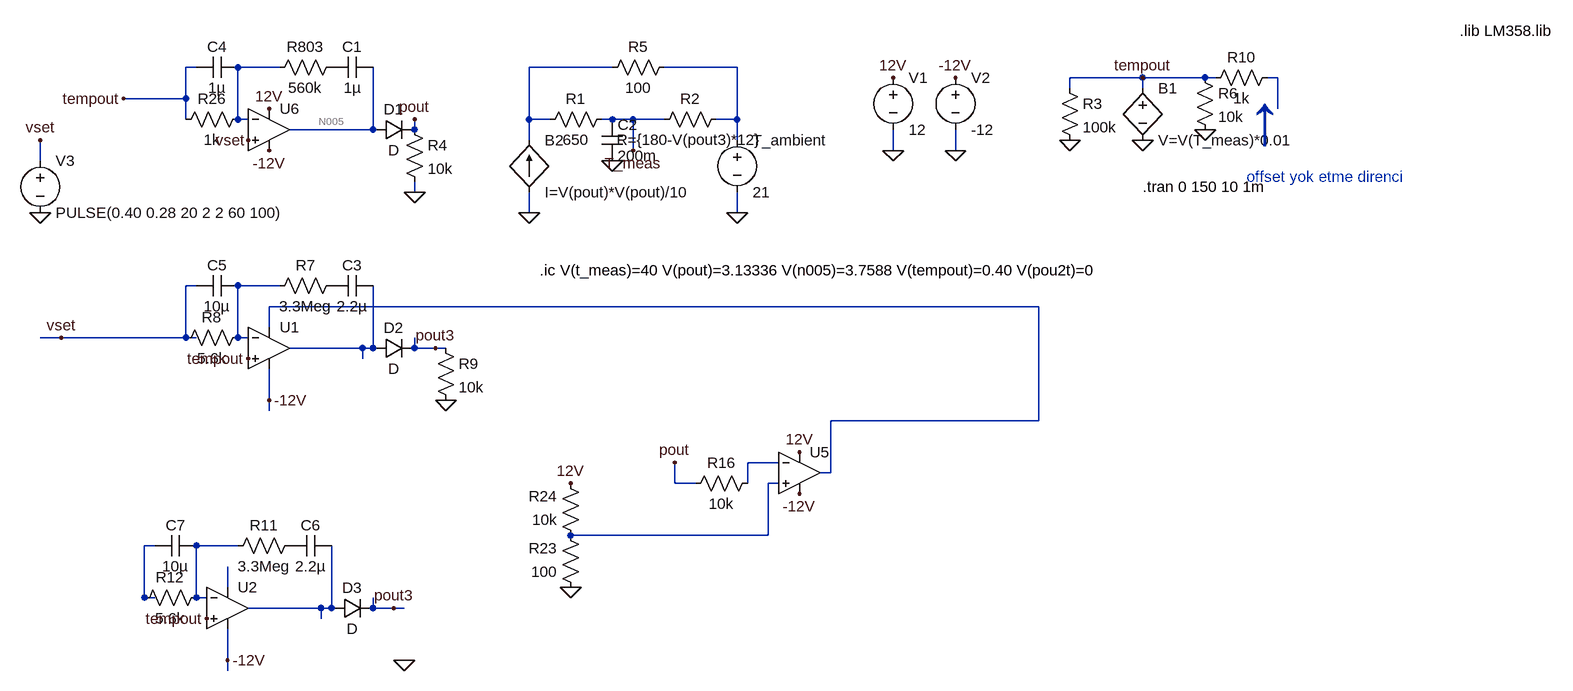
[diagram p0: schematic part-2v11.asc]
part-2v11.asc, the LTspice schematic file:
Version 4
SHEET 1 3304 1124
WIRE 1200 -336 1184 -336
WIRE 1328 -336 1264 -336
WIRE 1840 -336 1712 -336
WIRE 2032 -336 1920 -336
WIRE 2656 -320 2544 -320
WIRE 2752 -320 2656 -320
WIRE 2768 -320 2752 -320
WIRE 2864 -320 2848 -320
WIRE 2544 -304 2544 -320
WIRE 2656 -304 2656 -320
WIRE 1184 -288 1184 -336
WIRE 1184 -288 1088 -288
WIRE 2864 -272 2864 -320
WIRE 1184 -256 1184 -288
WIRE 1264 -256 1264 -336
WIRE 1280 -256 1264 -256
WIRE 1712 -256 1712 -336
WIRE 1744 -256 1712 -256
WIRE 1840 -256 1824 -256
WIRE 1872 -256 1840 -256
WIRE 1920 -256 1872 -256
WIRE 2032 -256 2032 -336
WIRE 2032 -256 2000 -256
WIRE 1472 -240 1472 -336
WIRE 1472 -240 1344 -240
WIRE 1536 -240 1536 -256
WIRE 1712 -224 1712 -256
WIRE 2032 -224 2032 -256
WIRE 1872 -208 1872 -256
WIRE 2272 -208 2272 -240
WIRE 2368 -208 2368 -240
WIRE 960 -192 960 -224
WIRE 1536 -144 1536 -160
WIRE 1712 -112 1712 -144
WIRE 2032 -112 2032 -144
WIRE 1200 0 1184 0
WIRE 1328 0 1264 0
WIRE 2496 32 1312 32
WIRE 1312 64 1312 32
WIRE 992 80 960 80
WIRE 1184 80 1184 0
WIRE 1184 80 992 80
WIRE 1200 80 1184 80
WIRE 1264 80 1264 0
WIRE 1280 80 1264 80
WIRE 1456 96 1344 96
WIRE 1472 96 1472 0
WIRE 1472 96 1456 96
WIRE 1536 96 1536 80
WIRE 1568 96 1536 96
WIRE 1584 96 1568 96
WIRE 1456 112 1456 96
WIRE 1312 176 1312 128
WIRE 1312 192 1312 176
WIRE 2496 208 2496 32
WIRE 2496 208 2176 208
WIRE 2096 272 2048 272
WIRE 2176 288 2176 208
WIRE 2176 288 2160 288
WIRE 1936 304 1936 272
WIRE 1968 304 1936 304
WIRE 2048 304 2048 272
WIRE 2096 304 2080 304
WIRE 2080 384 2080 304
WIRE 2080 384 1776 384
WIRE 1136 400 1120 400
WIRE 1264 400 1200 400
WIRE 1248 464 1248 432
WIRE 1120 480 1120 400
WIRE 1136 480 1120 480
WIRE 1200 480 1200 400
WIRE 1216 480 1200 480
WIRE 1392 496 1280 496
WIRE 1408 496 1408 400
WIRE 1408 496 1392 496
WIRE 1472 496 1472 480
WIRE 1504 496 1472 496
WIRE 1520 496 1504 496
WIRE 1392 512 1392 496
WIRE 1248 576 1248 528
WIRE 1248 592 1248 576
FLAG 2032 -112 0
FLAG 1712 -112 0
FLAG 1872 -208 T_meas
FLAG 2656 -224 0
FLAG 2544 -224 0
FLAG 2272 -208 0
FLAG 2272 -320 12V
FLAG 2368 -208 0
FLAG 2368 -320 -12V
FLAG 2752 -240 0
FLAG 1312 -208 -12V
FLAG 1312 -272 12V
FLAG 960 -112 0
FLAG 2656 -320 tempout
FLAG 1088 -288 tempout
FLAG 1840 -192 0
FLAG 1536 -256 pout
FLAG 1536 -144 0
FLAG 1280 112 tempout
FLAG 1584 176 0
FLAG 960 -224 vset
FLAG 1280 -224 vset
FLAG 992 80 vset
FLAG 2128 256 12V
FLAG 1568 96 pout3
FLAG 1936 272 pout
FLAG 2128 320 -12V
FLAG 1312 176 -12V
FLAG 1776 464 0
FLAG 1776 304 12V
FLAG 1216 512 tempout
FLAG 1520 576 0
FLAG 1504 496 pout3
FLAG 1248 576 -12V
SYMBOL voltage 2032 -240 R0
WINDOW 123 0 0 Left 0
WINDOW 39 0 0 Left 0
SYMATTR InstName T_ambient
SYMATTR Value 21
SYMBOL res 1840 -272 R90
WINDOW 0 0 56 VBottom 2
WINDOW 3 32 56 VTop 2
SYMATTR InstName R1
SYMATTR Value 650
SYMBOL res 2016 -272 R90
WINDOW 0 0 56 VBottom 2
WINDOW 3 32 56 VTop 2
SYMATTR InstName R2
SYMATTR Value R={180-V(pout3)*12}
SYMBOL bv 2656 -320 R0
SYMATTR InstName B1
SYMATTR Value V=V(T_meas)*0.01
SYMBOL res 2528 -320 R0
SYMATTR InstName R3
SYMATTR Value 100k
SYMBOL voltage 2272 -336 R0
SYMATTR InstName V1
SYMATTR Value 12
SYMBOL voltage 2368 -336 R0
WINDOW 123 0 0 Left 0
WINDOW 39 0 0 Left 0
SYMATTR InstName V2
SYMATTR Value -12
SYMBOL res 2736 -336 R0
SYMATTR InstName R6
SYMATTR Value 10k
SYMBOL res 2864 -336 R90
WINDOW 0 0 56 VBottom 2
WINDOW 3 32 56 VTop 2
SYMATTR InstName R10
SYMATTR Value 1k
SYMBOL Opamps\\UniversalOpamp2 1312 -240 R0
SYMATTR InstName U6
SYMBOL res 1424 -352 R90
WINDOW 0 0 56 VBottom 2
WINDOW 3 32 56 VTop 2
SYMATTR InstName R803
SYMATTR Value 560k
SYMBOL res 1280 -272 R90
WINDOW 0 0 56 VBottom 2
WINDOW 3 32 56 VTop 2
SYMATTR InstName R26
SYMATTR Value 1k
SYMBOL voltage 960 -208 R0
WINDOW 123 0 0 Left 0
WINDOW 39 0 0 Left 0
SYMATTR InstName V3
SYMATTR Value PULSE(0.40 0.28 20 2 2 60 100)
SYMBOL bi2 1712 -224 R0
SYMATTR InstName B2
SYMATTR Value I=V(pout)*V(pout)/10
SYMBOL cap 1824 -256 R0
SYMATTR InstName C2
SYMATTR Value 200m
SYMBOL res 1936 -352 R90
WINDOW 0 0 56 VBottom 2
WINDOW 3 32 56 VTop 2
SYMATTR InstName R5
SYMATTR Value 100
SYMBOL diode 1472 -224 R270
WINDOW 0 32 32 VTop 2
WINDOW 3 0 32 VBottom 2
SYMATTR InstName D1
SYMBOL res 1520 -256 R0
SYMATTR InstName R4
SYMATTR Value 10k
SYMBOL Opamps\\UniversalOpamp2 1312 96 R0
SYMATTR InstName U1
SYMBOL res 1424 -16 R90
WINDOW 0 0 56 VBottom 2
WINDOW 3 32 56 VTop 2
SYMATTR InstName R7
SYMATTR Value 3.3Meg
SYMBOL res 1280 64 R90
WINDOW 0 0 56 VBottom 2
WINDOW 3 32 56 VTop 2
SYMATTR InstName R8
SYMATTR Value 5.6k
SYMBOL cap 1472 -16 R90
WINDOW 0 0 32 VBottom 2
WINDOW 3 32 32 VTop 2
SYMATTR InstName C3
SYMATTR Value 2.2µ
SYMBOL cap 1264 -16 R90
WINDOW 0 0 32 VBottom 2
WINDOW 3 32 32 VTop 2
SYMATTR InstName C5
SYMATTR Value 10µ
SYMBOL diode 1472 112 R270
WINDOW 0 32 32 VTop 2
WINDOW 3 0 32 VBottom 2
SYMATTR InstName D2
SYMBOL res 1568 80 R0
SYMATTR InstName R9
SYMATTR Value 10k
SYMBOL cap 1472 -352 R90
WINDOW 0 0 32 VBottom 2
WINDOW 3 32 32 VTop 2
SYMATTR InstName C1
SYMATTR Value 1µ
SYMBOL cap 1264 -352 R90
WINDOW 0 0 32 VBottom 2
WINDOW 3 32 32 VTop 2
SYMATTR InstName C4
SYMATTR Value 1µ
SYMBOL res 2064 288 R90
WINDOW 0 0 56 VBottom 2
WINDOW 3 32 56 VTop 2
SYMATTR InstName R16
SYMATTR Value 10k
SYMBOL Opamps\\UniversalOpamp2 2128 288 R0
SYMATTR InstName U5
SYMBOL res 1792 480 R180
WINDOW 0 36 76 Left 2
WINDOW 3 36 40 Left 2
SYMATTR InstName R23
SYMATTR Value 100
SYMBOL res 1792 400 R180
WINDOW 0 36 76 Left 2
WINDOW 3 36 40 Left 2
SYMATTR InstName R24
SYMATTR Value 10k
SYMBOL Opamps\\UniversalOpamp2 1248 496 R0
SYMATTR InstName U2
SYMBOL res 1360 384 R90
WINDOW 0 0 56 VBottom 2
WINDOW 3 32 56 VTop 2
SYMATTR InstName R11
SYMATTR Value 3.3Meg
SYMBOL res 1216 464 R90
WINDOW 0 0 56 VBottom 2
WINDOW 3 32 56 VTop 2
SYMATTR InstName R12
SYMATTR Value 5.6k
SYMBOL cap 1408 384 R90
WINDOW 0 0 32 VBottom 2
WINDOW 3 32 32 VTop 2
SYMATTR InstName C6
SYMATTR Value 2.2µ
SYMBOL cap 1200 384 R90
WINDOW 0 0 32 VBottom 2
WINDOW 3 32 32 VTop 2
SYMATTR InstName C7
SYMATTR Value 10µ
SYMBOL diode 1408 512 R270
WINDOW 0 32 32 VTop 2
WINDOW 3 0 32 VBottom 2
SYMATTR InstName D3
TEXT 2656 -152 Left 2 !.tran 0 150 10 1m
TEXT 3144 -392 Left 2 !.lib LM358.lib
TEXT 2816 -168 Left 2 ;offset yok etme direnci
TEXT 2816 -256 Left 7 ;↑
TEXT 1728 -24 Left 2 !.ic V(t_meas)=40 V(pout)=3.13336 V(n005)=3.7588 V(tempout)=0.40 V(pou2t)=0

The netlist it stands for:
* part-2v11.asc
V§T_ambient N003 0 21
R1 T_meas N002 650
R2 N003 T_meas R={180-V(pout3)*12}
B1 tempout 0 V=V(T_meas)*0.01
R3 tempout 0 100k
V1 12V 0 12
V2 -12V 0 -12
R6 tempout 0 10k
R10 N004 tempout 1k
XU6 vset N001 12V -12V N005 level.2 Avol=1Meg GBW=10Meg Slew=10Meg ilimit=25m rail=0 Vos=0 phimargin=45 en=0 enk=0 in=0 ink=0 Rin=500Meg  ; pins IN+ IN- V+ V- OUT
R803 P001 N001 560k
R26 N001 tempout 1k
V3 vset 0 PULSE(0.40 0.28 20 2 2 60 100)
B2 0 N002 I=V(pout)*V(pout)/10
C2 T_meas 0 200m
R5 N003 N002 100
D1 N005 pout D
R4 pout 0 10k
XU1 tempout N006 N007 -12V N008 level.2 Avol=1Meg GBW=10Meg Slew=10Meg ilimit=25m rail=0 Vos=0 phimargin=45 en=0 enk=0 in=0 ink=0 Rin=500Meg  ; pins IN+ IN- V+ V- OUT
R7 P002 N006 3.3Meg
R8 N006 vset 5.6k
C3 N008 P002 2.2µ
C5 N006 vset 10µ
D2 N008 pout3 D
R9 pout3 0 10k
C1 N005 P001 1µ
C4 N001 tempout 1µ
R16 N009 pout 10k
XU5 N010 N009 12V -12V N007 level.2 Avol=1Meg GBW=10Meg Slew=10Meg ilimit=25m rail=0 Vos=0 phimargin=45 en=0 enk=0 in=0 ink=0 Rin=500Meg  ; pins IN+ IN- V+ V- OUT
R23 0 N010 100
R24 N010 12V 10k
XU2 tempout N012 N013 -12V N014 level.2 Avol=1Meg GBW=10Meg Slew=10Meg ilimit=25m rail=0 Vos=0 phimargin=45 en=0 enk=0 in=0 ink=0 Rin=500Meg  ; pins IN+ IN- V+ V- OUT
R11 P003 N012 3.3Meg
R12 N012 N011 5.6k
C6 N014 P003 2.2µ
C7 N012 N011 10µ
D3 N014 pout3 D
.model D D
.lib standard.dio
.tran 0 150 10 1m
.lib LM358.lib
* offset yok etme direnci
* ↑
.ic V(t_meas)=40 V(pout)=3.13336 V(n005)=3.7588 V(tempout)=0.40 V(pou2t)=0
.lib UniversalOpamps2.sub
.backanno
.end